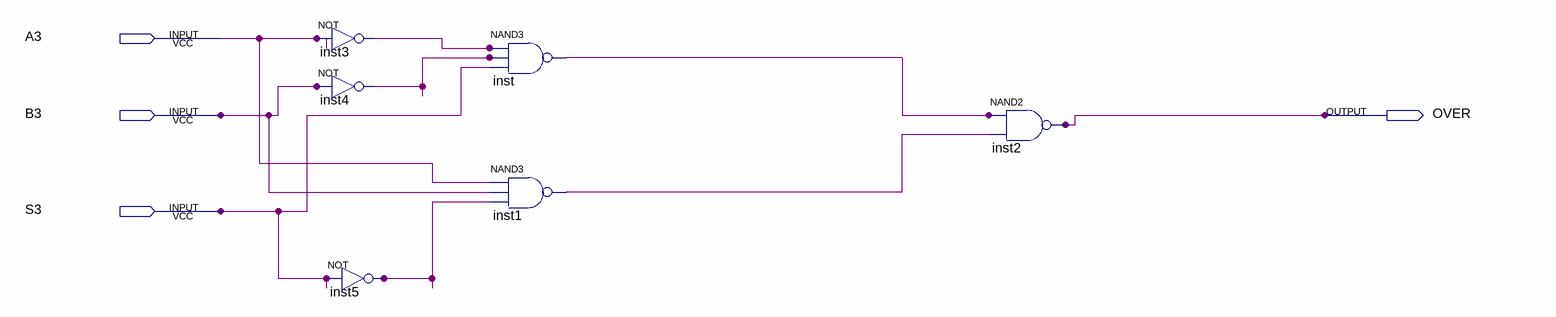
[diagram p0: schematic sheet]
// Quartus schematic Overflow.bdf as structural Verilog: 6 symbols, 4 pins
module Overflow (
  input  A3,
  input  B3,
  input  S3,
  output OVER
);

  wire inst1_out, inst3_out, inst4_out, inst5_out, inst_out;

  not inst3 (inst3_out, A3);
  not inst4 (inst4_out, B3);
  not inst5 (inst5_out, S3);
  nand inst (inst_out, inst3_out, inst4_out, S3);
  nand inst1 (inst1_out, A3, B3, inst5_out);
  nand inst2 (OVER, inst_out, inst1_out);
endmodule
